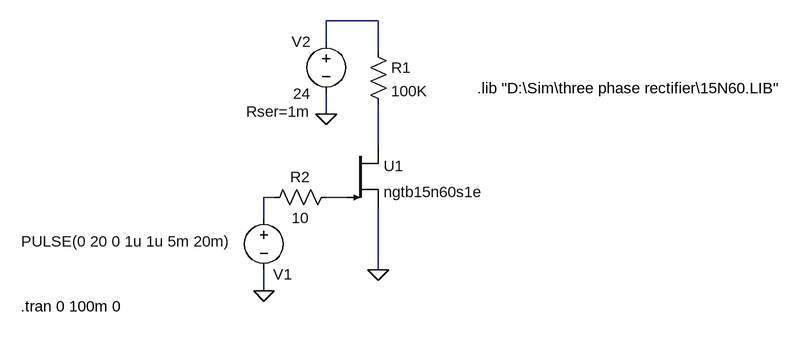
[diagram p0: schematic igbt.asc]
igbt.asc, the LTspice schematic file:
Version 4
SHEET 1 1092 804
WIRE 240 -80 160 -80
WIRE 160 -48 160 -80
WIRE 240 -32 240 -80
WIRE 160 64 160 32
WIRE 240 112 240 48
WIRE 80 192 64 192
WIRE 192 192 160 192
WIRE 64 224 64 192
WIRE 240 304 240 208
WIRE 64 336 64 304
FLAG 160 64 0
FLAG 64 336 0
FLAG 240 304 0
SYMBOL Misc\\nigbt 192 112 R0
SYMATTR InstName U1
SYMATTR Value ngtb15n60s1e
SYMBOL voltage 64 208 R0
WINDOW 3 -373 52 Left 2
WINDOW 123 0 0 Left 2
WINDOW 39 0 0 Left 2
WINDOW 0 14 103 Left 2
SYMATTR Value PULSE(0 20 0 1u 1u 5m 20m)
SYMATTR InstName V1
SYMBOL voltage 160 -64 M0
WINDOW 123 0 0 Left 2
WINDOW 39 24 124 Left 2
SYMATTR SpiceLine Rser=1m
SYMATTR InstName V2
SYMATTR Value 24
SYMBOL res 64 208 R270
WINDOW 0 32 56 VTop 2
WINDOW 3 0 56 VBottom 2
SYMATTR InstName R2
SYMATTR Value 10
SYMATTR SpiceLine tol=1 pwr=1
SYMBOL res 224 -48 R0
SYMATTR InstName R1
SYMATTR Value 100K
SYMATTR SpiceLine tol=1 pwr=0.1
TEXT 392 24 Left 2 !.lib "D:\\Sim\\three phase rectifier\\15N60.LIB"
TEXT -310 360 Left 2 !.tran 0 100m 0

The netlist it stands for:
* igbt.asc
Z§U1 N002 N004 0 ngtb15n60s1e
V1 N003 0 PULSE(0 20 0 1u 1u 5m 20m)
V2 N001 0 24 Rser=1m
R2 N003 N004 10 tol=1 pwr=1
R1 N001 N002 100K tol=1 pwr=0.1
.lib "D:\Sim\three phase rectifier\15N60.LIB"
.tran 0 100m 0
.backanno
.end